# Altium project Test_001_Bd.PrjPcb
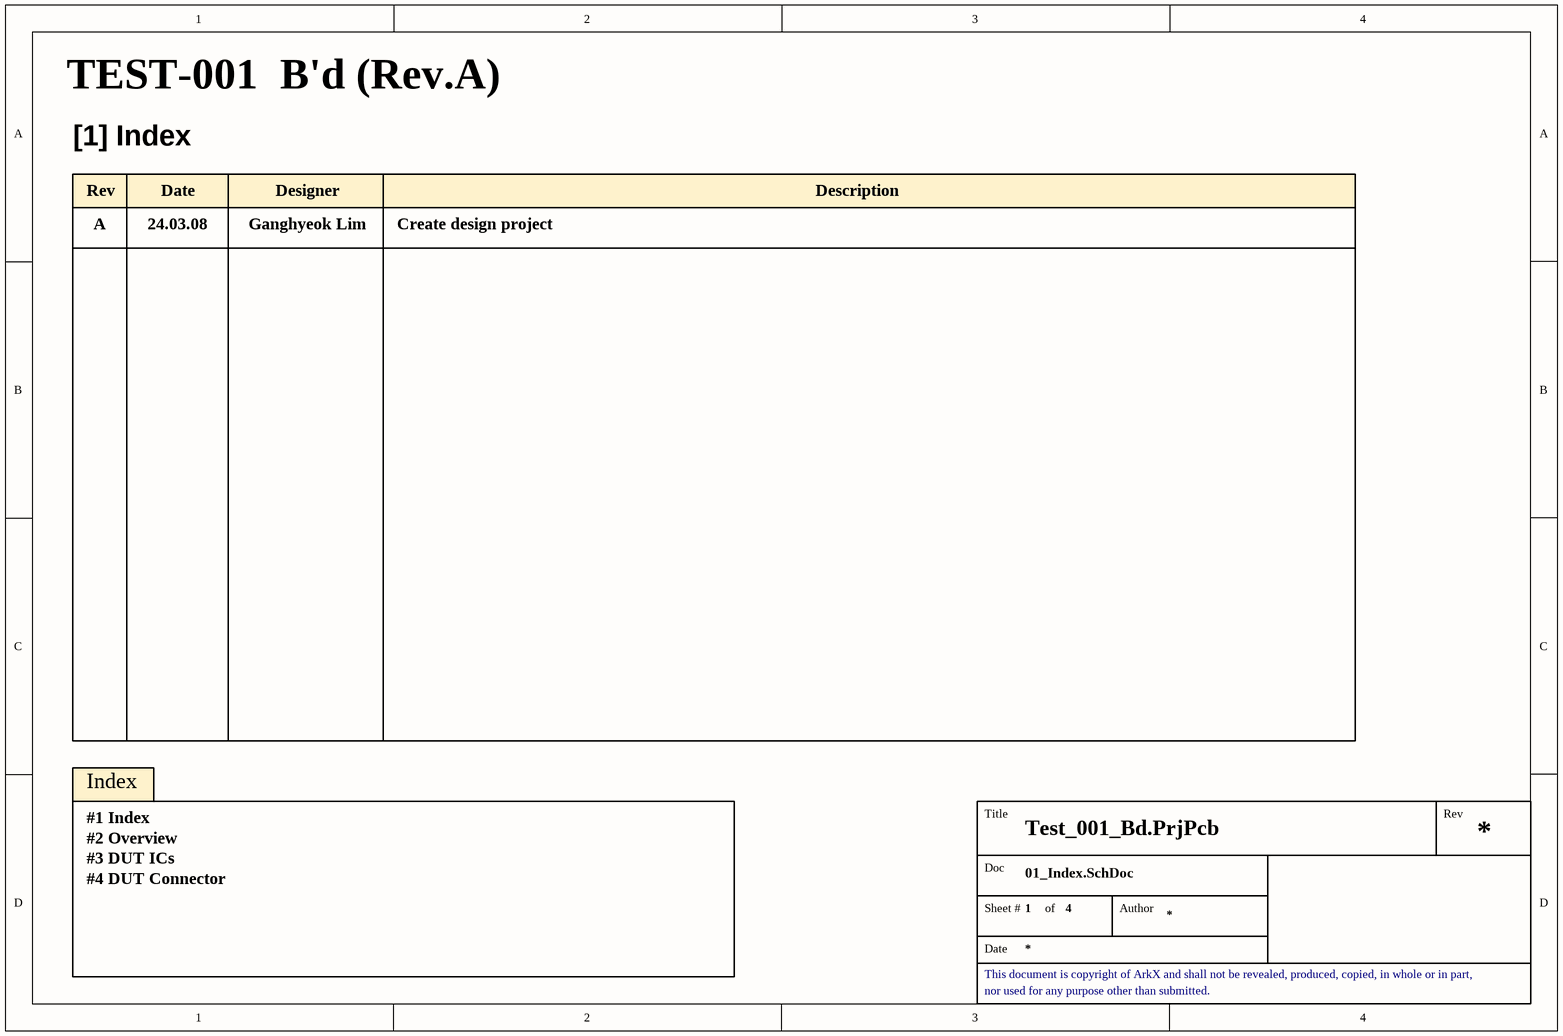
[diagram p0: 01_Index.SchDoc]
4 sheets, 100 parts. Net scope: global (net labels, ports and power ports of the same name join across sheets).
Board file: TEST001_Bd.PcbDoc
Sheets:
  01_Index.SchDoc
  02_Overview.SchDoc
  03_DUT_ICs.SchDoc
  04_DUT_Connector.SchDoc

## Sheet 01_Index.SchDoc
size A4; SheetNumber: 1; SheetTotal: 4

### Notes on the sheet
- TEST-001  B'd (Rev.A)
- [1] Index
- Rev
- A
- 24.03.08
- Date
- Ganghyeok Lim
- Designer
- Create design project
- Description
- Index
- #1 Index
- #2 Overview
- #3 DUT ICs
- #4 DUT Connector
- Title
- Doc
- Sheet #
- of
- Author
- This document is copyright of ArkX and shall not be revealed, produced, copied, in whole or in part,
- nor used for any purpose other than submitted.

## Sheet 02_Overview.SchDoc
size A4; SheetNumber: 2; SheetTotal: 4
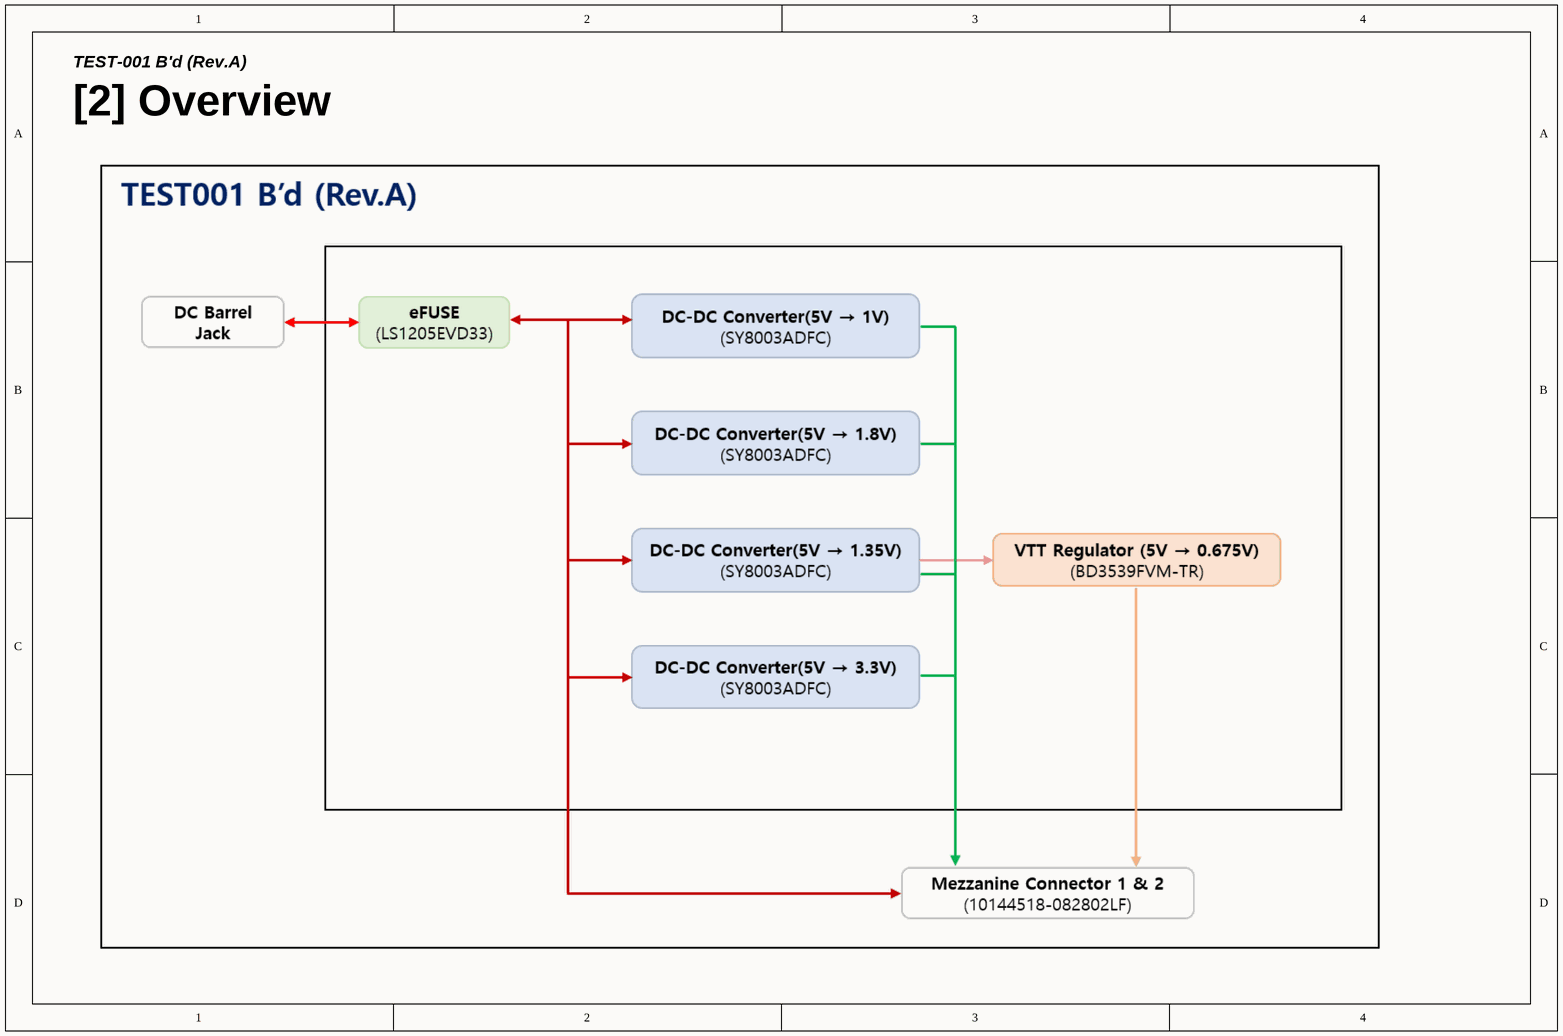
[diagram p1: 02_Overview.SchDoc]

### Notes on the sheet
- TEST-001 B'd (Rev.A)
- [2] Overview
- Title
- Rev
- Doc
- Sheet #
- of
- Author
- This document is copyright of ArkX and shall not be revealed, produced, copied, in whole or in part,
- Date
- nor used for any purpose other than submitted.

## Sheet 03_DUT_ICs.SchDoc
size A3; SheetNumber: 3; SheetTotal: 4
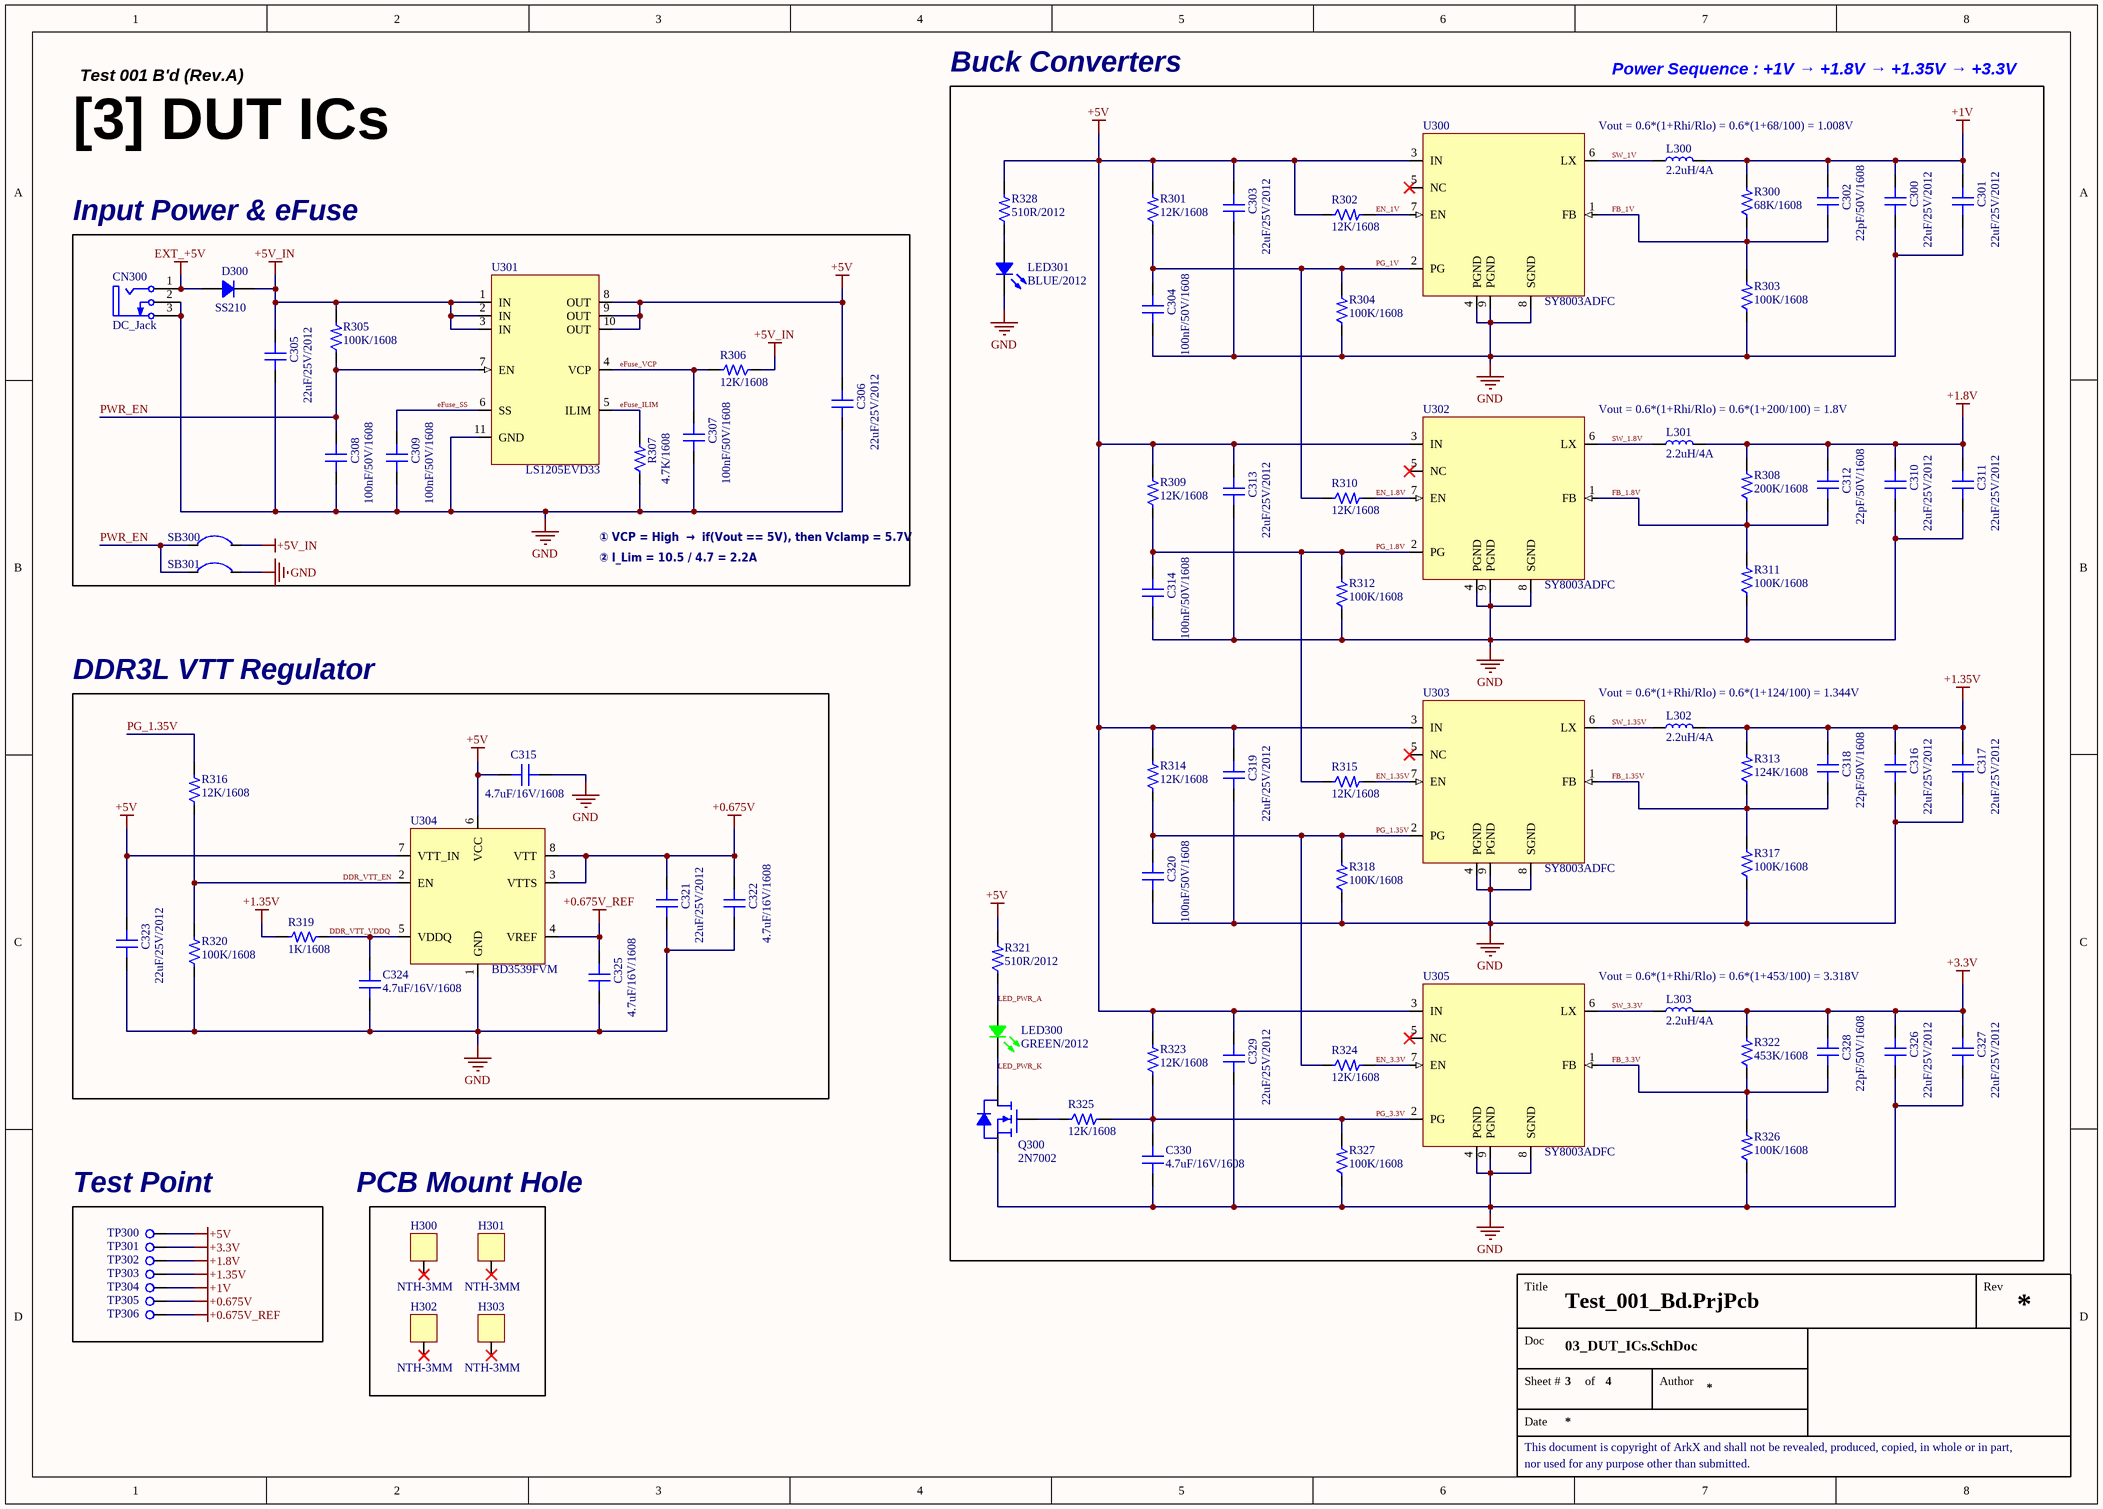
[diagram p2: 03_DUT_ICs.SchDoc]

### Parts
C300  22uF/25V/2012  [CAP 2012 (0805_INCH)]
C301  22uF/25V/2012  [CAP 2012 (0805_INCH)]
C302  22pF/50V/1608  [CAP 1608 (0603_INCH)]
C303  22uF/25V/2012  [CAP 2012 (0805_INCH)]
C304  100nF/50V/1608  [CAP 1608 (0603_INCH)]
C305  22uF/25V/2012  [CAP 2012 (0805_INCH)]
C306  22uF/25V/2012  [CAP 2012 (0805_INCH)]
C307  100nF/50V/1608  [CAP 1608 (0603_INCH)]
C308  100nF/50V/1608  [CAP 1608 (0603_INCH)]
C309  100nF/50V/1608  [CAP 1608 (0603_INCH)]
C310  22uF/25V/2012  [CAP 2012 (0805_INCH)]
C311  22uF/25V/2012  [CAP 2012 (0805_INCH)]
C312  22pF/50V/1608  [CAP 1608 (0603_INCH)]
C313  22uF/25V/2012  [CAP 2012 (0805_INCH)]
C314  100nF/50V/1608  [CAP 1608 (0603_INCH)]
C315  4.7uF/16V/1608  [CAP 1608 (0603_INCH)]
C316  22uF/25V/2012  [CAP 2012 (0805_INCH)]
C317  22uF/25V/2012  [CAP 2012 (0805_INCH)]
C318  22pF/50V/1608  [CAP 1608 (0603_INCH)]
C319  22uF/25V/2012  [CAP 2012 (0805_INCH)]
C320  100nF/50V/1608  [CAP 1608 (0603_INCH)]
C321  22uF/25V/2012  [CAP 2012 (0805_INCH)]
C322  4.7uF/16V/1608  [CAP 1608 (0603_INCH)]
C323  22uF/25V/2012  [CAP 2012 (0805_INCH)]
C324  4.7uF/16V/1608  [CAP 1608 (0603_INCH)]
C325  4.7uF/16V/1608  [CAP 1608 (0603_INCH)]
C326  22uF/25V/2012  [CAP 2012 (0805_INCH)]
C327  22uF/25V/2012  [CAP 2012 (0805_INCH)]
C328  22pF/50V/1608  [CAP 1608 (0603_INCH)]
C329  22uF/25V/2012  [CAP 2012 (0805_INCH)]
C330  4.7uF/16V/1608  [CAP 1608 (0603_INCH)]
CN300  DC_Jack  [CON DC-Jack]
D300  SS210  [DIO DO-214AC (SMA)]
H300  NTH-3MM  [HOLE NTH-3MM]
H301  NTH-3MM  [HOLE NTH-3MM]
H302  NTH-3MM  [HOLE NTH-3MM]
H303  NTH-3MM  [HOLE NTH-3MM]
L300  2.2uH/4A  [IND BWVS006060282R2M00]
L301  2.2uH/4A  [IND BWVS006060282R2M00]
L302  2.2uH/4A  [IND BWVS006060282R2M00]
L303  2.2uH/4A  [IND BWVS006060282R2M00]
LED300  GREEN/2012  [LED MHT170RGBCT (GREEN)]
LED301  BLUE/2012  [LED MHT170RGBCT (BLUE)]
Q300  2N7002  [SOT 23-3 (DIODES INCORPORATED)]
R300  68K/1608  [RES 1608 (0603_inch)]
R301  12K/1608  [RES 1608 (0603_inch)]
R302  12K/1608  [RES 1608 (0603_inch)]
R303  100K/1608  [RES 1608 (0603_inch)]
R304  100K/1608  [RES 1608 (0603_inch)]
R305  100K/1608  [RES 1608 (0603_inch)]
R306  12K/1608  [RES 1608 (0603_inch)]
R307  4.7K/1608  [RES 1608 (0603_inch)]
R308  200K/1608  [RES 1608 (0603_inch)]
R309  12K/1608  [RES 1608 (0603_inch)]
R310  12K/1608  [RES 1608 (0603_inch)]
R311  100K/1608  [RES 1608 (0603_inch)]
R312  100K/1608  [RES 1608 (0603_inch)]
R313  124K/1608  [RES 1608 (0603_inch)]
R314  12K/1608  [RES 1608 (0603_inch)]
R315  12K/1608  [RES 1608 (0603_inch)]
R316  12K/1608  [RES 1608 (0603_inch)]
R317  100K/1608  [RES 1608 (0603_inch)]
R318  100K/1608  [RES 1608 (0603_inch)]
R319  1K/1608  [RES 1608 (0603_inch)]
R320  100K/1608  [RES 1608 (0603_inch)]
R321  510R/2012  [RES 2012 (0805_inch)]
R322  453K/1608  [RES 1608 (0603_inch)]
R323  12K/1608  [RES 1608 (0603_inch)]
R324  12K/1608  [RES 1608 (0603_inch)]
R325  12K/1608  [RES 1608 (0603_inch)]
R326  100K/1608  [RES 1608 (0603_inch)]
R327  100K/1608  [RES 1608 (0603_inch)]
R328  510R/2012  [RES 2012 (0805_inch)]
SB300  SB  [SB (Solder-Bridge)]  (value not drawn)
SB301  SB  [SB (Solder-Bridge)]  (value not drawn)
TP300  TP_CIRCLE  [TP Circle]  (value not drawn)
TP301  TP_CIRCLE  [TP Circle]  (value not drawn)
TP302  TP_CIRCLE  [TP Circle]  (value not drawn)
TP303  TP_CIRCLE  [TP Circle]  (value not drawn)
TP304  TP_CIRCLE  [TP Circle]  (value not drawn)
TP305  TP_CIRCLE  [TP Circle]  (value not drawn)
TP306  TP_CIRCLE  [TP Circle]  (value not drawn)
U300  SY8003ADFC  [IC_DFN_2X2_8L]
U301  LS1205EVD33  [IC_DFN_3x3_10L]
U302  SY8003ADFC  [IC_DFN_2X2_8L]
U303  SY8003ADFC  [IC_DFN_2X2_8L]
U304  BD3539FVM  [IC_MSOP-8]
U305  SY8003ADFC  [IC_DFN_2X2_8L]

### Blocks framed on the sheet
Buck Converters: C300-C304 C310-C314 C316-C320 C326-C330 L300-L303 LED300 LED301 Q300 R300-R304 R308-R315 R317 R318 R321-R328 U300 U302 U303 U305
Input Power & eFuse: C305-C309 CN300 D300 R305-R307 SB300 SB301 U301
DDR3L VTT Regulator: C315 C321-C325 R316 R319 R320 U304
Test Point: TP300-TP306

### Nets
+0.675V: C321.2 C322.2 TP305.1(TP) U304.3(VTTS) U304.8(VTT)
+0.675V_REF: C325.2 TP306.1(TP) U304.4(VREF)
+1.8V: C310.2 C311.2 C312.2 L301.2 R308.2 TP302.1(TP)
+1.35V: C316.2 C317.2 C318.2 L302.2 R313.2 R319.2 TP303.1(TP)
+1V: C300.2 C301.2 C302.2 L300.2 R300.2 TP304.1(TP)
+3.3V: C326.2 C327.2 C328.2 L303.2 R322.2 TP301.1(TP)
+5V: C303.2 C306.2 C313.2 C315.2 C319.2 C323.2 C329.2 R301.2 R302.1 R309.2 R314.2 R321.2 R323.2 R328.2 TP300.1(TP) U300.3(IN) U301.8(OUT) U301.9(OUT) U301.10(OUT) U302.3(IN) U303.3(IN) U304.6(VCC) U304.7(VTT_IN) U305.3(IN)
+5V_IN: C305.2 D300.2 R305.2 R306.1 SB300.2 U301.1(IN) U301.2(IN) U301.3(IN)
EXT_+5V: CN300.1(VCC) D300.1
GND: C300.1 C301.1 C303.1 C304.1 C305.1 C306.1 C307.1 C308.1 C309.1 C310.1 C311.1 C313.1 C314.1 C315.1 C316.1 C317.1 C319.1 C320.1 C321.1 C322.1 C323.1 C324.1 C325.1 C326.1 C327.1 C329.1 C330.1 CN300.2(GND) CN300.3(GND) LED301.3(BLUE) Q300.2(S) R303.1 R304.1 R307.1 R311.1 R312.1 R317.1 R318.1 R320.1 R326.1 R327.1 SB301.2 U300.4(PGND) U300.8(SGND) U300.9(PGND) U301.11(GND) U302.4(PGND) U302.8(SGND) U302.9(PGND) U303.4(PGND) U303.8(SGND) U303.9(PGND) U304.1(GND) U305.4(PGND) U305.8(SGND) U305.9(PGND)
DDR_VTT_EN: R316.1 R320.2 U304.2(EN)
DDR_VTT_VDDQ: C324.2 R319.1 U304.5(VDDQ)
eFuse_ILIM: R307.2 U301.5(ILIM)
eFuse_SS: C309.2 U301.6(SS)
eFuse_VCP: C307.2 R306.2 U301.4(VCP)
EN_1.8V: R310.2 U302.7(EN)
EN_1.35V: R315.2 U303.7(EN)
EN_1V: R302.2 U300.7(EN)
EN_3.3V: R324.2 U305.7(EN)
FB_1.8V: C312.1 R308.1 R311.2 U302.1(FB)
FB_1.35V: C318.1 R313.1 R317.2 U303.1(FB)
FB_1V: C302.1 R300.1 R303.2 U300.1(FB)
FB_3.3V: C328.1 R322.1 R326.2 U305.1(FB)
LED_PWR_A: LED300.4(Common_Anode) R321.1
LED_PWR_K: LED300.2(GREEN) Q300.3(D)
PG_1.8V: C314.2 R309.1 R312.2 R315.1 U302.2(PG)
PG_1.35V: C320.2 R314.1 R316.2 R318.2 R324.1 U303.2(PG)
PG_1V: C304.2 R301.1 R304.2 R310.1 U300.2(PG)
PG_3.3V: C330.2 R323.1 R325.2 R327.2 U305.2(PG)
PWR_EN: C308.2 R305.1 SB300.1 SB301.1 U301.7(EN)
SW_1.8V: L301.1 U302.6(LX)
SW_1.35V: L302.1 U303.6(LX)
SW_1V: L300.1 U300.6(LX)
SW_3.3V: L303.1 U305.6(LX)
NetLED301_4: LED301.4(Common_Anode) R328.1
NetQ300_1: Q300.1(G) R325.1

Not connected (* = marked no-connect by the designer): H300 1*; H301 1*; H302 1*; H303 1*; U300 5(NC)*; U302 5(NC)*; U303 5(NC)*; U305 5(NC)*

### Notes on the sheet
- Test 001 B'd (Rev.A)
- Power Sequence : +1V → +1.8V → +1.35V → +3.3V
- [3] DUT ICs
- Vout = 0.6*(1+Rhi/Rlo) = 0.6*(1+68/100) = 1.008V
- Vout = 0.6*(1+Rhi/Rlo) = 0.6*(1+200/100) = 1.8V
- ① VCP = High  →  if(Vout == 5V), then Vclamp = 5.7V
- ② I_Lim = 10.5 / 4.7 = 2.2A
- Vout = 0.6*(1+Rhi/Rlo) = 0.6*(1+124/100) = 1.344V
- Vout = 0.6*(1+Rhi/Rlo) = 0.6*(1+453/100) = 3.318V
- PCB Mount Hole
- Title
- Rev
- Doc
- Sheet #
- of
- Author
- This document is copyright of ArkX and shall not be revealed, produced, copied, in whole or in part,
- Date
- nor used for any purpose other than submitted.

### Library data of the parts
C300 C301 C303 C305 C306 C310 C311 C313 C316 C317 C319 C321 C323 C326 C327 C329 = CAP_22uF/25V/2012: Ceramic CAP_22uF/25V/2012; LCSC Part #: C45783; JLCPCB Part Type: Basic Part
C302 C312 C318 C328 = CAP_22pF/50V/1608: Ceramic CAP_22pF/50V/1608; LCSC Part #: C1653; JLCPCB Part Type: Basic Part
C304 C307-C309 C314 C320 = CAP_100nF/50V/1608: Ceramic CAP_100nF/50V/1608; LCSC Part #: C14663; JLCPCB Part Type: Basic Part
C315 C322 C324 C325 C330 = CAP_4.7uF/16V/1608: Ceramic CAP_4.7uF/16V/1608; LCSC Part #: C19666; JLCPCB Part Type: Basic Part
CN300 = CON_DC-Jack: ComponentLink1Description: Manufacturer Link; ComponentLink1URL: http://www.cliffuk.co.uk/
D300 = DIO_SS210: 100V 850mV@2A 2A SMA(DO-214AC)  Schottky Barrier Diodes (SBD) ROHS; LCSC Part #: C14996; JLCPCB Part Type: Basic Part
H300-H303 = HOLE_NTH-3MM: Non-Through Hole 3mm
L300-L303 = IND_BWVS006060282R2M00: FIXED IND 2.2uH 4A 20mohm SMD; Supplier 1: Digi-Key; Supplier 2: Mouser
LED300 = LED_MHT170RGBCT(GREEN): Colorless transparence -30℃~+85℃ Positive post Common anode RGB 120° 0805  Light Emitting Diodes (LED) ROHS; LCSC Part #: C2962094; JLCPCB Part Type: Extended Part
LED301 = LED_MHT170RGBCT(BLUE): Colorless transparence -30℃~+85℃ Positive post Common anode RGB 120° 0805  Light Emitting Diodes (LED) ROHS; LCSC Part #: C2962094; JLCPCB Part Type: Extended Part
Q300 = FET_2N7002: 60V 115mA 200mW 7.5Ω@10V,500mA N Channel SOT-23  MOSFETs ROHS; LCSC Part #: C8545; JLCPCB Part Type: Basic Part
R300 = RES_68K/1608/0.1W: Value: 68K; Power Rating: 0.1W; Precision: 1%; Size: 1608; LCSC Part #: C23231; JLCPCB Part Type: Basic Part
R301 R302 R306 R309 R310 R314-R316 R323-R325 = RES_12K/1608/0.1W: Value: 12K; Power Rating: 0.1W; Precision: 1%; Size: 1608; LCSC Part #: C22790; JLCPCB Part Type: Basic Part
R303-R305 R311 R312 R317 R318 R320 R326 R327 = RES_100K/1608/0.1W: Value: 100K; Power Rating: 0.1W; Precision: 1%; Size: 1608; LCSC Part #: C25803; JLCPCB Part Type: Basic Part
R307 = RES_4.7K/1608/0.1W: Value: 4.7K; Power Rating: 0.1W; Precision: 1%; Size: 1608; LCSC Part #: C23162; JLCPCB Part Type: Basic Part
R308 = RES_200K/1608/0.1W: Value: 200K; Power Rating: 0.1W; Precision: 1%; Size: 1608; LCSC Part #: C25811; JLCPCB Part Type: Basic Part
R313 = RES_124K/1608/0.1W: Value: 124K; Power Rating: 0.1W; Precision: 1%; Size: 1608; LCSC Part #: C140118; JLCPCB Part Type: Extended Part
R319 = RES_1K/1608/0.1W: Value: 1K; Power Rating: 0.1W; Precision: 1%; Size: 1608; LCSC Part #: C21190; JLCPCB Part Type: Basic Part
R321 R328 = RES_510R/2012/0.125W: Value: 510R; Power Rating: 0.125W; Precision: 1%; Size: 2012; LCSC Part #: C17734; JLCPCB Part Type: Basic Part
R322 = RES_453K/1608/0.1W: Value: 453K; Power Rating: 0.1W; Precision: 1%; Size: 1608; LCSC Part #: C25818; JLCPCB Part Type: Extended Part
SB300 SB301 = SB_Solder-Bridge
U300 U302 U303 U305 = IC_REG_SY8003ADFC: High Efficiency 5.5V, 3A Continuous, 1MHz Synchronous Step Down Regulator; Manufacturer: Silergy; Manufacturer Part Number: High Efficiency 5.5V, 3A continuous, 1MHz; JLCPCB Part Type: Extended Part; LCSC Part #: C178236
U301 = IC_eFUSE_LS1205EVD33: 18V, 5A eFuse with Programmable Current Limit and Output Voltage Clamp, 10-DFN (3x3)
U304 = IC_REG_VTT_BD3539FVM: 1.0V to 5.5V, 1A 1ch / Termination Regulators for DDR-SDRAMs, 8-MSOP

## Sheet 04_DUT_Connector.SchDoc
size A4; SheetNumber: 4; SheetTotal: 4
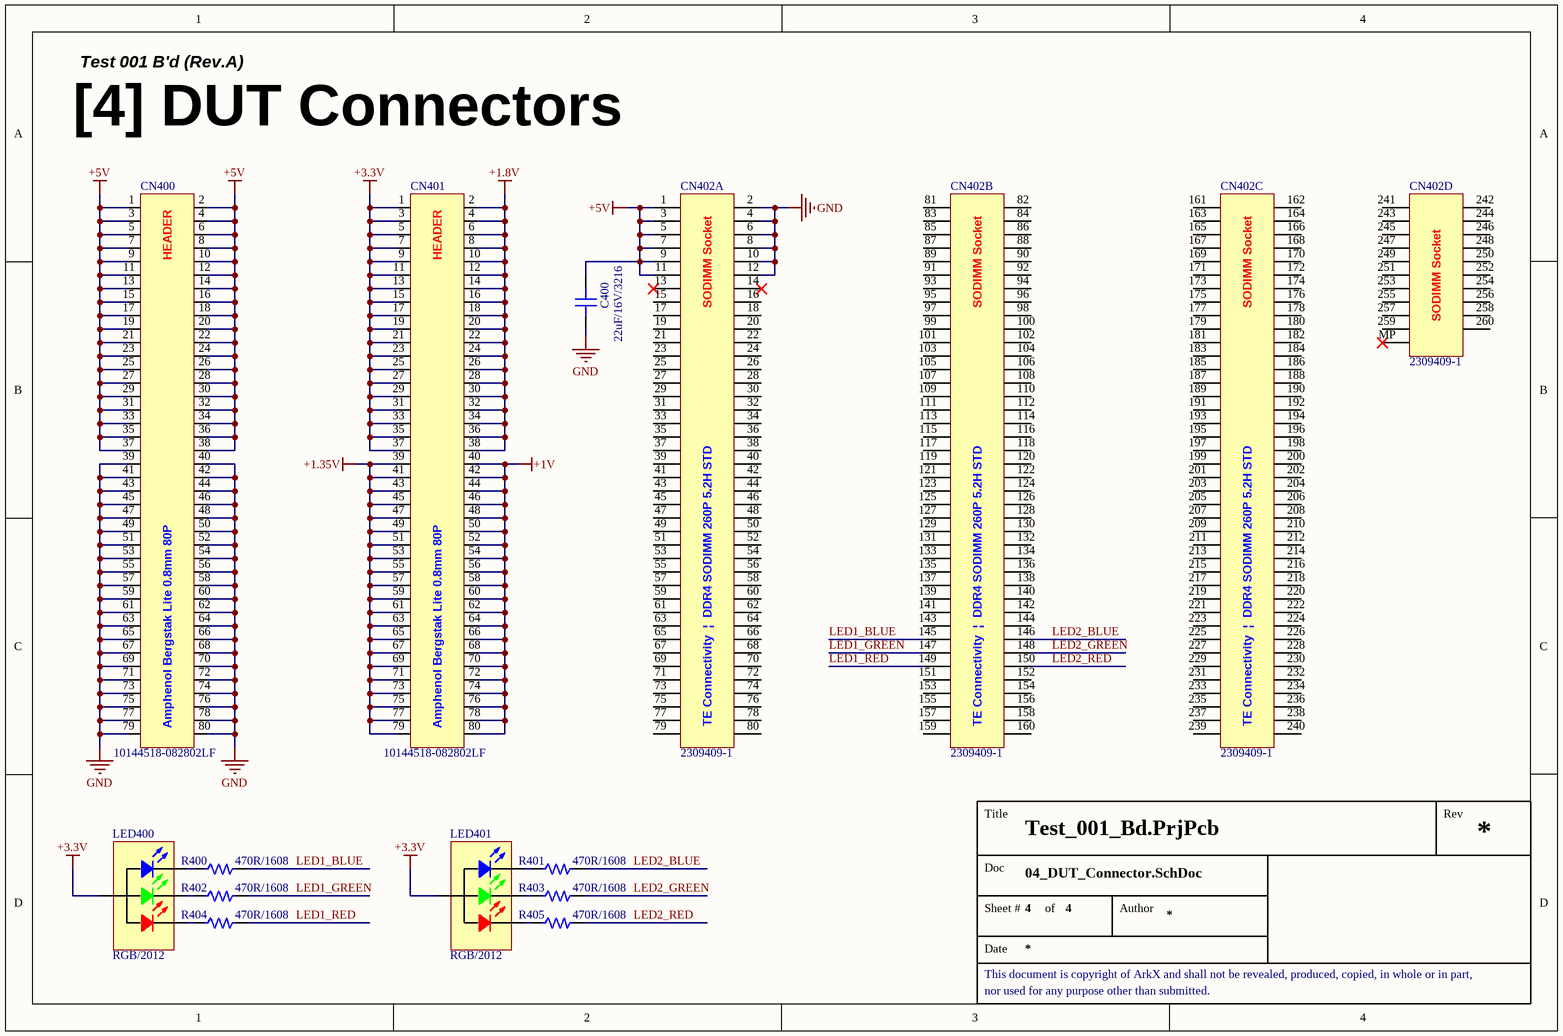
[diagram p3: 04_DUT_Connector.SchDoc]

### Parts
C400  22uF/16V/3216  [CAP 3216 (1206_INCH) - H1.8MM]
CN400  10144518-082802LF  [10144518-082802LF]
CN401  10144518-082802LF  [10144518-082802LF]
CN402  2309409-1  [CON_SODIMM_2309409-1]  (parts A,B,C,D of 4)
LED400  RGB/2012  [LED MHT170RGBCT]
LED401  RGB/2012  [LED MHT170RGBCT]
R400  470R/1608  [RES 1608 (0603_inch)]
R401  470R/1608  [RES 1608 (0603_inch)]
R402  470R/1608  [RES 1608 (0603_inch)]
R403  470R/1608  [RES 1608 (0603_inch)]
R404  470R/1608  [RES 1608 (0603_inch)]
R405  470R/1608  [RES 1608 (0603_inch)]

### Nets
+1.8V: CN401.2 CN401.4 CN401.6 CN401.8 CN401.10 CN401.12 CN401.14 CN401.16 CN401.18 CN401.20 CN401.22 CN401.24 CN401.26 CN401.28 CN401.30 CN401.32 CN401.34 CN401.36 CN401.38
+1.35V: CN401.39 CN401.41 CN401.43 CN401.45 CN401.47 CN401.49 CN401.51 CN401.53 CN401.55 CN401.57 CN401.59 CN401.61 CN401.63 CN401.65 CN401.67 CN401.69 CN401.71 CN401.73 CN401.75 CN401.77 CN401.79
+1V: CN401.40 CN401.42 CN401.44 CN401.46 CN401.48 CN401.50 CN401.52 CN401.54 CN401.56 CN401.58 CN401.60 CN401.62 CN401.64 CN401.66 CN401.68 CN401.70 CN401.72 CN401.74 CN401.76 CN401.78 CN401.80
+3.3V: CN401.1 CN401.3 CN401.5 CN401.7 CN401.9 CN401.11 CN401.13 CN401.15 CN401.17 CN401.19 CN401.21 CN401.23 CN401.25 CN401.27 CN401.29 CN401.31 CN401.33 CN401.35 CN401.37 LED400.4(Common_Anode) LED401.4(Common_Anode)
+5V: C400.2 CN400.1 CN400.2 CN400.3 CN400.4 CN400.5 CN400.6 CN400.7 CN400.8 CN400.9 CN400.10 CN400.11 CN400.12 CN400.13 CN400.14 CN400.15 CN400.16 CN400.17 CN400.18 CN400.19 CN400.20 CN400.21 CN400.22 CN400.23 CN400.24 CN400.25 CN400.26 CN400.27 CN400.28 CN400.29 CN400.30 CN400.31 CN400.32 CN400.33 CN400.34 CN400.35 CN400.36 CN400.37 CN400.38 CN402.1 CN402.3 CN402.5 CN402.7 CN402.9 CN402.11
GND: C400.1 CN400.39 CN400.40 CN400.41 CN400.42 CN400.43 CN400.44 CN400.45 CN400.46 CN400.47 CN400.48 CN400.49 CN400.50 CN400.51 CN400.52 CN400.53 CN400.54 CN400.55 CN400.56 CN400.57 CN400.58 CN400.59 CN400.60 CN400.61 CN400.62 CN400.63 CN400.64 CN400.65 CN400.66 CN400.67 CN400.68 CN400.69 CN400.70 CN400.71 CN400.72 CN400.73 CN400.74 CN400.75 CN400.76 CN400.77 CN400.78 CN400.79 CN400.80 CN402.2 CN402.4 CN402.6 CN402.8 CN402.10 CN402.12
LED1_BLUE: CN402.145 R400.2
LED1_GREEN: CN402.147 R402.2
LED1_RED: CN402.149 R404.2
LED2_BLUE: CN402.146 R401.2
LED2_GREEN: CN402.148 R403.2
LED2_RED: CN402.150 R405.2
NetLED400_1: LED400.1(RED) R404.1
NetLED400_2: LED400.2(GREEN) R402.1
NetLED400_3: LED400.3(BLUE) R400.1
NetLED401_1: LED401.1(RED) R405.1
NetLED401_2: LED401.2(GREEN) R403.1
NetLED401_3: LED401.3(BLUE) R401.1

Not connected (* = marked no-connect by the designer): CN402 13* 14* 15 16 17 18 19 20 21 22 23 24 25 26 27 28 29 30 31 32 33 34 35 36 37 38 39 40 41 42 43 44 45 46 47 48 49 50 51 52 53 54 55 56 57 58 59 60 61 62 63 64 65 66 67 68 69 70 71 72 73 74 75 76 77 78 79 80 81 82 83 84 85 86 87 88 89 90 91 92 93 94 95 96 97 98 99 100 101 102 103 104 105 106 107 108 109 110 111 112 113 114 115 116 117 118 119 120 121 122 123 124 125 126 127 128 129 130 131 132 133 134 135 136 137 138 139 140 141 142 143 144 151 152 153 154 155 156 157 158 159 160 161 162 163 164 165 166 167 168 169 170 171 172 173 174 175 176 177 178 179 180 181 182 183 184 185 186 187 188 189 190 191 192 193 194 195 196 197 198 199 200 201 202 203 204 205 206 207 208 209 210 211 212 213 214 215 216 217 218 219 220 221 222 223 224 225 226 227 228 229 230 231 232 233 234 235 236 237 238 239 240 241 242 243 244 245 246 247 248 249 250 251 252 253 254 255 256 257 258 259 260 MP*

### Notes on the sheet
- Test 001 B'd (Rev.A)
- [4] DUT Connectors
- Title
- Rev
- Doc
- Sheet #
- of
- Author
- This document is copyright of ArkX and shall not be revealed, produced, copied, in whole or in part,
- Date
- nor used for any purpose other than submitted.
- (in symbol CON_10144518-082802LF) HEADER; Amphenol Bergstak Lite 0.8mm 80P
- (in symbol CON_SODIMM_2309409-1, part A) SODIMM Socket; TE Connectivity  |  DDR4 SODIMM 260P 5.2H STD
- (in symbol CON_SODIMM_2309409-1, part B) SODIMM Socket; TE Connectivity  |  DDR4 SODIMM 260P 5.2H STD
- (in symbol CON_SODIMM_2309409-1, part C) SODIMM Socket; TE Connectivity  |  DDR4 SODIMM 260P 5.2H STD
- (in symbol CON_SODIMM_2309409-1, part D) SODIMM Socket

### Library data of the parts
C400 = CAP_22uF/16V/3216: Ceramic CAP_22uF/16V/3216; LCSC Part #: C12891; JLCPCB Part Type: Basic Part
CN400 CN401 = CON_10144518-082802LF: BergStak® Lite 0.80mm, Board-to-Board Connector, 80 Positions, Dual Row, Vertical Header; Manufacturer: Amphenol; Manufacturer Part Number: 10144518-082802LF
CN402 = CON_SODIMM_2309409-1: SO DIMM Socket, Small Outline (SO), Stack Height .205 in [5.2 mm], Right Angle Module Orientation, 260 Position, DDR4 DIMM; Manufacturer: TE Connectivity; Manufacturer Part Number: 2309409-1; JLCPCB Part Type: Extended Part; LCSC Part #: C5164025
LED400 LED401 = LED_RGB_MHT170RGBCT: Colorless transparence -30℃~+85℃ Positive post Common anode RGB 120° 0805  Light Emitting Diodes (LED) ROHS; LCSC Part #: C2962094; JLCPCB Part Type: Extended Part
R400-R405 = RES_470R/1608/0.1W: Value: 470R; Power Rating: 0.1W; Precision: 1%; Size: 1608; LCSC Part #: C23179; JLCPCB Part Type: Basic Part

## Nets that join several sheets
+1.8V: 03_DUT_ICs (6 pins), 04_DUT_Connector (19 pins)
+1.35V: 03_DUT_ICs (7 pins), 04_DUT_Connector (21 pins)
+1V: 03_DUT_ICs (6 pins), 04_DUT_Connector (21 pins)
+3.3V: 03_DUT_ICs (6 pins), 04_DUT_Connector (21 pins)
+5V: 03_DUT_ICs (24 pins), 04_DUT_Connector (45 pins)
GND: 03_DUT_ICs (56 pins), 04_DUT_Connector (49 pins)